# Altium schematic sheet LEDs.SchDoc: Thymio2
size A3; Engineer: Michael Bonani; Organization: Original design LSRO-STI-EPFL; Address1: Association Mobsya; Address2: Michael Bonani; Address3: Ch. Closel 3; Address4: CH-1020 Renens; DocumentNumber: 6; Revision: 2.3; SheetNumber: 6; SheetTotal: 9; Title2: PCB principal
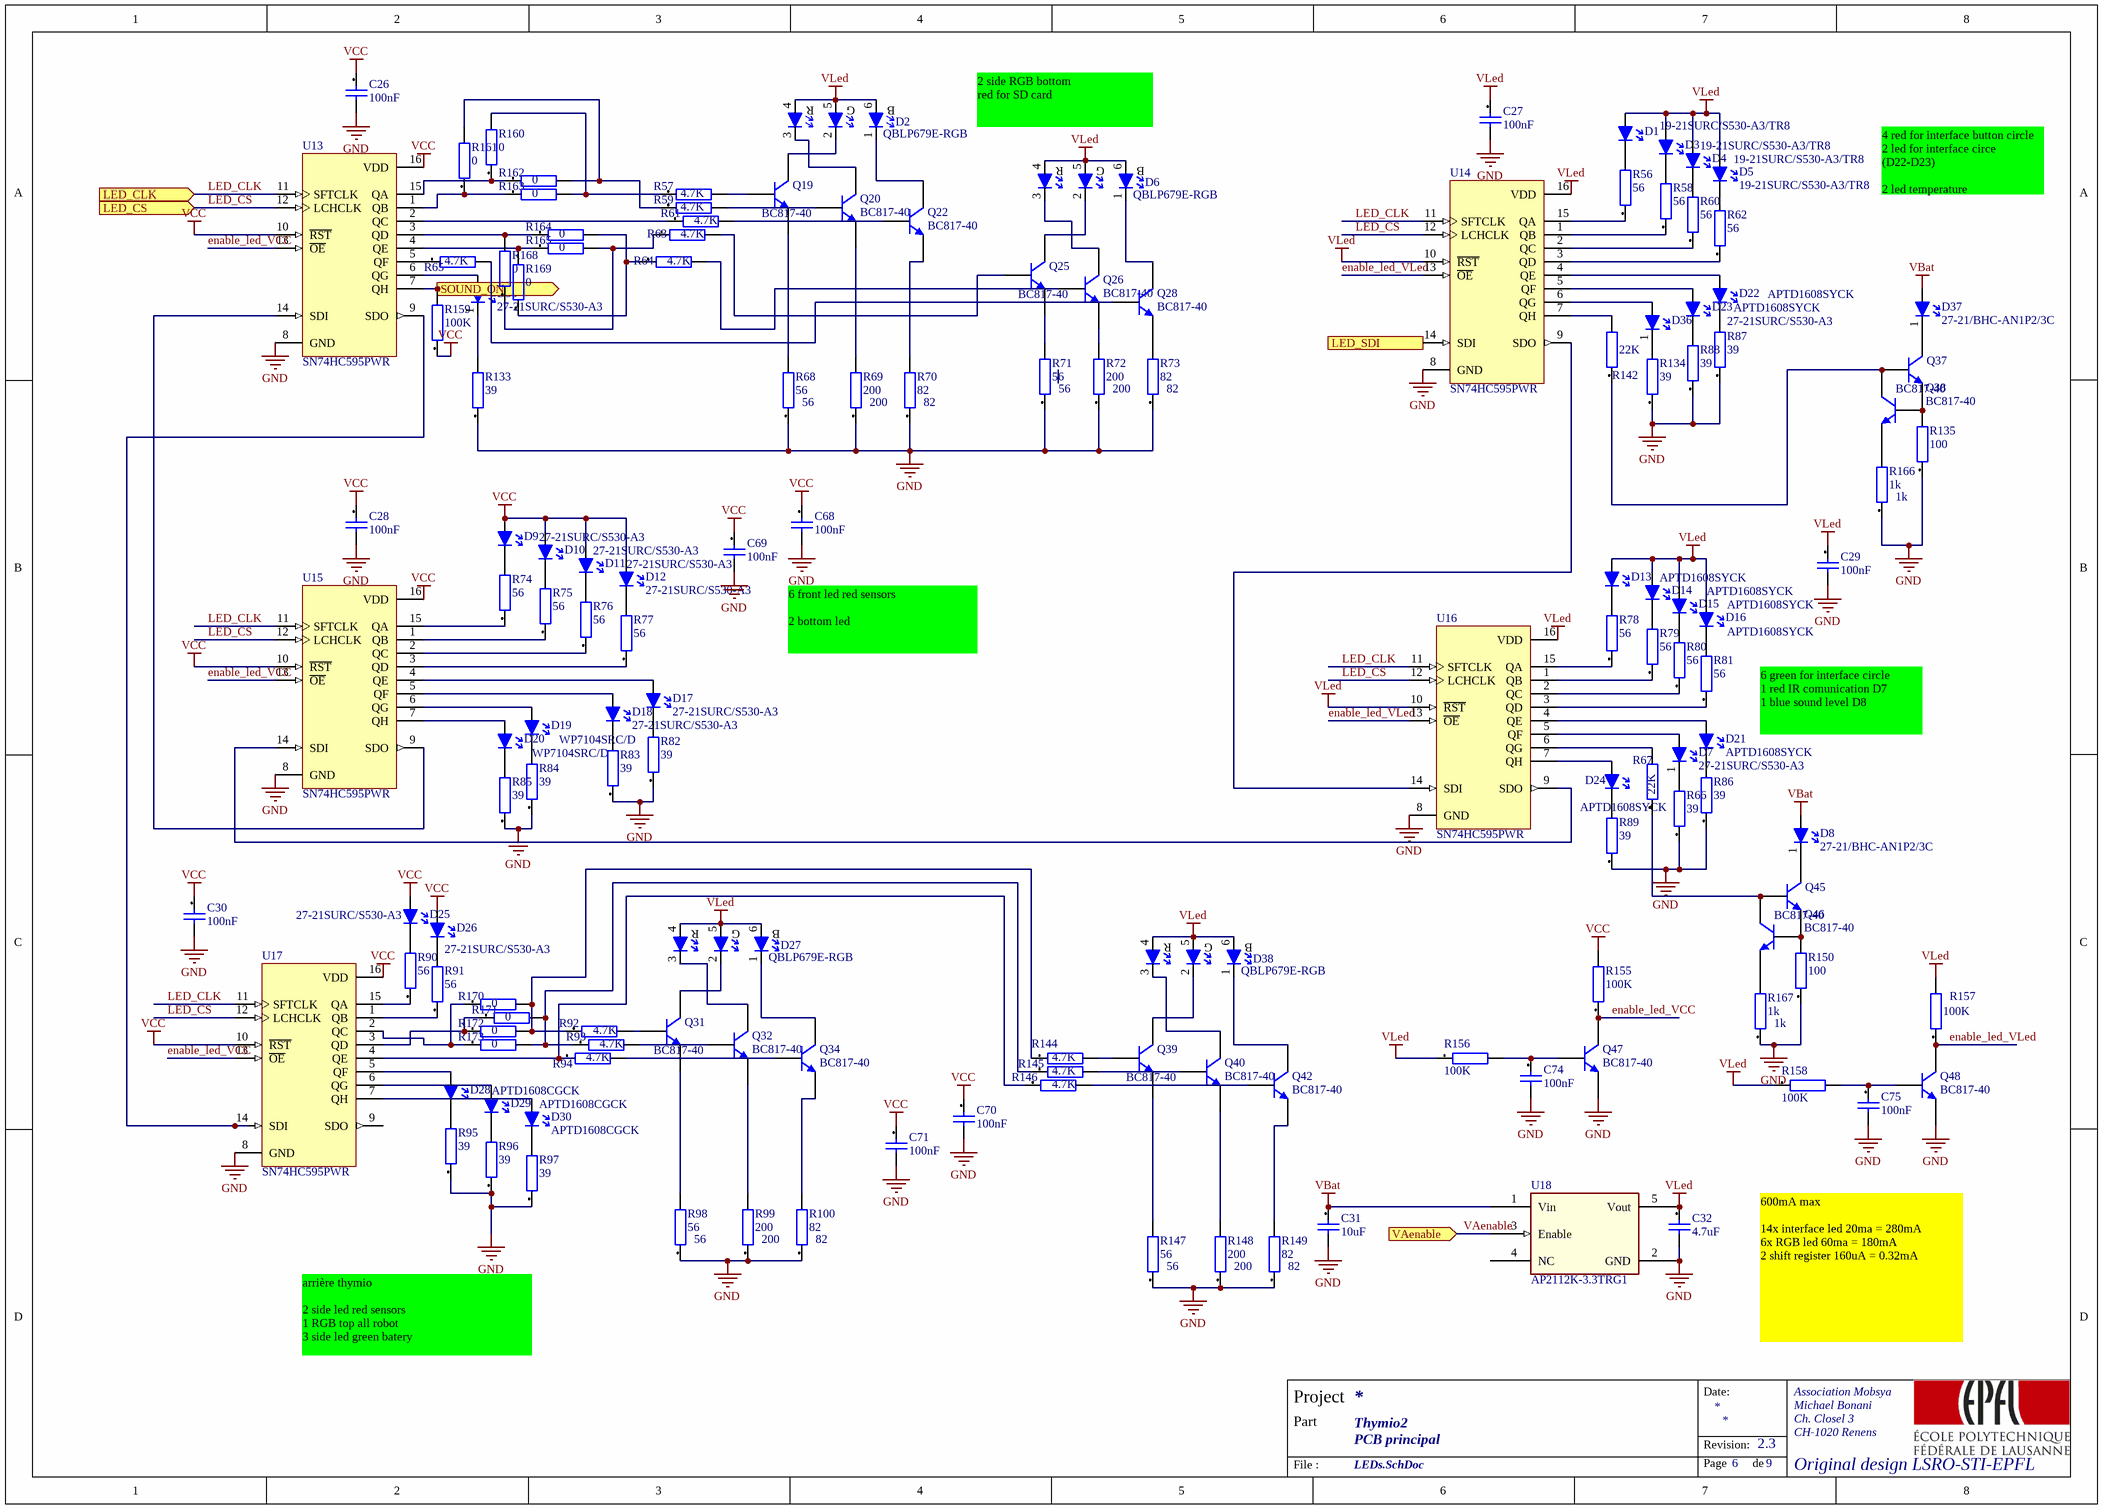
[diagram p0: LEDs.SchDoc]

## Parts
C26  100nF  [CAPC1005X05N]
C27  100nF  [CAPC1005X05N]
C28  100nF  [CAPC1005X05N]
C29  100nF  [CAPC1005X05N]
C30  100nF  [CAPC1005X05N]
C31  10uF  [CAPC1005X05N]
C32  4.7uF  [CAPC1005X05N]
C68  100nF  [CAPC1005X05N]
C69  100nF  [CAPC1005X05N]
C70  100nF  [CAPC1005X05N]
C71  100nF  [CAPC1005X05N]
C74  100nF  [CAPC1005X05N]
C75  100nF  [CAPC1005X05N]
D1  19-21SURC/S530-A3/TR8  [DIOC1608X08N]
D2  QBLP679E-RGB  [QBLP679E-RGB]
D3  19-21SURC/S530-A3/TR8  [DIOC1608X08N]
D4  19-21SURC/S530-A3/TR8  [DIOC1608X08N]
D5  19-21SURC/S530-A3/TR8  [DIOC1608X08N]
D6  QBLP679E-RGB  [QBLP679E-RGB]
D7  27-21SURC/S530-A3  [27-21 Everlight]
D8  27-21/BHC-AN1P2/3C  [27-21 Everlight Blue]
D9  27-21SURC/S530-A3  [27-21 Everlight]
D10  27-21SURC/S530-A3  [27-21 Everlight]
D11  27-21SURC/S530-A3  [27-21 Everlight]
D12  27-21SURC/S530-A3  [27-21 Everlight]
D13  APTD1608SYCK  [DIOC1608X08N]
D14  APTD1608SYCK  [DIOC1608X08N]
D15  APTD1608SYCK  [DIOC1608X08N]
D16  APTD1608SYCK  [DIOC1608X08N]
D17  27-21SURC/S530-A3  [27-21 Everlight]
D18  27-21SURC/S530-A3  [27-21 Everlight]
D19  WP7104SRC/D  [Led_TH_3mm_20mm]
D20  WP7104SRC/D  [Led_TH_3mm_20mm]
D21  APTD1608SYCK  [DIOC1608X08N]
D22  APTD1608SYCK  [DIOC1608X08N]
D23  APTD1608SYCK  [DIOC1608X08N]
D24  APTD1608SYCK  [DIOC1608X08N]
D25  27-21SURC/S530-A3  [27-21 Everlight]
D26  27-21SURC/S530-A3  [27-21 Everlight]
D27  QBLP679E-RGB  [QBLP679E-RGB]
D28  APTD1608CGCK  [DIOC1608X08N]
D29  APTD1608CGCK  [DIOC1608X08N]
D30  APTD1608CGCK  [DIOC1608X08N]
D35  27-21SURC/S530-A3  [27-21 Everlight]
D36  27-21SURC/S530-A3  [27-21 Everlight]
D37  27-21/BHC-AN1P2/3C  [27-21 Everlight Blue]
D38  QBLP679E-RGB  [QBLP679E-RGB]
Q19  BC817-40  [SOT23_N]
Q20  BC817-40  [SOT23_N]
Q22  BC817-40  [SOT23_N]
Q25  BC817-40  [SOT23_N]
Q26  BC817-40  [SOT23_N]
Q28  BC817-40  [SOT23_N]
Q31  BC817-40  [SOT23_N]
Q32  BC817-40  [SOT23_N]
Q34  BC817-40  [SOT23_N]
Q37  BC817-40  [SOT23_N]
Q38  BC817-40  [SOT23_N]
Q39  BC817-40  [SOT23_N]
Q40  BC817-40  [SOT23_N]
Q42  BC817-40  [SOT23_N]
Q45  BC817-40  [SOT23_N]
Q46  BC817-40  [SOT23_N]
Q47  BC817-40  [SOT23_N]
Q48  BC817-40  [SOT23_N]
R56  56  [RESC1005X04N]
R57  4.7K  [RESC1005X04N]
R58  56  [RESC1005X04N]
R59  4.7K  [RESC1005X04N]
R60  56  [RESC1005X04N]
R61  4.7K  [RESC1005X04N]
R62  56  [RESC1005X04N]
R63  4.7K  [RESC1005X04N]
R64  4.7K  [RESC1005X04N]
R65  4.7K  [RESC1005X04N]
R66  39  [RESC1005X04N]
R67  22K  [RESC1005X04N]
R68  56  [RESC1005X04N]
R69  200  [RESC1005X04N]
R70  82  [RESC1005X04N]
R71  56  [RESC1005X04N]
R72  200  [RESC1005X04N]
R73  82  [RESC1005X04N]
R74  56  [RESC1005X04N]
R75  56  [RESC1005X04N]
R76  56  [RESC1005X04N]
R77  56  [RESC1005X04N]
R78  56  [RESC1005X04N]
R79  56  [RESC1005X04N]
R80  56  [RESC1005X04N]
R81  56  [RESC1005X04N]
R82  39  [RESC1005X04N]
R83  39  [RESC1005X04N]
R84  39  [RESC1005X04N]
R85  39  [RESC1005X04N]
R86  39  [RESC1005X04N]
R87  39  [RESC1005X04N]
R88  39  [RESC1005X04N]
R89  39  [RESC1005X04N]
R90  56  [RESC1005X04N]
R91  56  [RESC1005X04N]
R92  4.7K  [RESC1005X04N]
R93  4.7K  [RESC1005X04N]
R94  4.7K  [RESC1005X04N]
R95  39  [RESC1005X04N]
R96  39  [RESC1005X04N]
R97  39  [RESC1005X04N]
R98  56  [RESC1005X04N]
R99  200  [RESC1005X04N]
R100  82  [RESC1005X04N]
R133  39  [RESC1005X04N]
R134  39  [RESC1005X04N]
R135  100  [RESC1005X04N]
R142  22K  [RESC1005X04N]
R144  4.7K  [RESC1005X04N]
R145  4.7K  [RESC1005X04N]
R146  4.7K  [RESC1005X04N]
R147  56  [RESC1005X04N]
R148  200  [RESC1005X04N]
R149  82  [RESC1005X04N]
R150  100  [RESC1005X04N]
R155  100K  [RESC1005X04N]
R156  100K  [RESC1005X04N]
R157  100K  [RESC1005X04N]
R158  100K  [RESC1005X04N]
R159  100K  [RESC1005X04N]
R160  0  [RESC1005X04N]
R161  0  [RESC1005X04N]
R162  0  [RESC1005X04N]
R163  0  [RESC1005X04N]
R164  0  [RESC1005X04N]
R165  0  [RESC1005X04N]
R166  1k  [RESC1005X04N]
R167  1k  [RESC1005X04N]
R168  0  [RESC1005X04N]
R169  0  [RESC1005X04N]
R170  0  [RESC1005X04N]
R171  0  [RESC1005X04N]
R172  0  [RESC1005X04N]
R173  0  [RESC1005X04N]
U13  SN74HC595PWR  [948F-01_N]
U14  SN74HC595PWR  [948F-01_N]
U15  SN74HC595PWR  [948F-01_N]
U16  SN74HC595PWR  [948F-01_N]
U17  SN74HC595PWR  [948F-01_N]
U18  AP2112K-3.3TRG1  [SOT95P285X100-5N]

## Ports
LED_CLK (in), LED_CS (in), LED_SDI (in), SOUND_ON (out), VAenable (in)

## Nets
GND: C26.2 C27.2 C28.2 C29.2 C30.2 C31.2 C32.2 C68.2 C69.2 C70.2 C71.2 C74.2 C75.2 Q47.2(E) Q48.2(E) R66.1 R68.1 R69.1 R70.1 R71.1 R72.1 R73.1 R82.1 R83.1 R84.1 R85.1 R86.1 R87.1 R88.1 R89.1 R95.1 R96.1 R97.1 R98.1 R99.1 R100.1 R133.1 R134.1 R135.1 R147.1 R148.1 R149.1 R150.1 R166.1 R167.1 U13.8(GND) U14.8(GND) U15.8(GND) U16.8(GND) U17.8(GND) U18.2(GND)
VBat: C31.1 D8.2(A) D37.2(A) U18.1(Vin)
VCC: C26.1 C28.1 C30.1 C68.1 C69.1 C70.1 C71.1 D9.2(A) D10.2(A) D11.2(A) D12.2(A) D25.2(A) D26.2(A) R155.2 R159.1 U13.10(~{RST}) U13.16(VDD) U15.10(~{RST}) U15.16(VDD) U17.10(~{RST}) U17.16(VDD)
VLed: C27.1 C29.1 C32.1 D1.2(A) D2.4(Ar) D2.5(Ag) D2.6(Ab) D3.2(A) D4.2(A) D5.2(A) D6.4(Ar) D6.5(Ag) D6.6(Ab) D13.2(A) D14.2(A) D15.2(A) D16.2(A) D27.4(Ar) D27.5(Ag) D27.6(Ab) D38.4(Ar) D38.5(Ag) D38.6(Ab) R156.1 R157.2 R158.1 U14.10(~{RST}) U14.16(VDD) U16.10(~{RST}) U16.16(VDD) U18.5(Vout)
enable_led_VCC: Q47.3(C) R155.1 U13.13(~{OE}) U15.13(~{OE}) U17.13(~{OE})
enable_led_VLed: Q48.3(C) R157.1 U14.13(~{OE}) U16.13(~{OE})
LED_CLK: U13.11(SFTCLK) U14.11(SFTCLK) U15.11(SFTCLK) U16.11(SFTCLK) U17.11(SFTCLK) ; port LED_CLK
LED_CS: U13.12(LCHCLK) U14.12(LCHCLK) U15.12(LCHCLK) U16.12(LCHCLK) U17.12(LCHCLK) ; port LED_CS
LED_SDI: U14.14(SDI) ; port LED_SDI
SOUND_ON: R159.2 U13.7(QH) ; port SOUND_ON
VAenable: U18.3(Enable) ; port VAenable
NetC74_1: C74.1 Q47.1(B) R156.2
NetC75_1: C75.1 Q48.1(B) R158.2
NetD1_1: D1.1(K) R56.2
NetD2_1: D2.1(Kb) Q22.3(C)
NetD2_2: D2.2(Kg) Q19.3(C)
NetD2_3: D2.3(Kr) Q20.3(C)
NetD3_1: D3.1(K) R58.2
NetD4_1: D4.1(K) R60.2
NetD5_1: D5.1(K) R62.2
NetD6_1: D6.1(Kb) Q28.3(C)
NetD6_2: D6.2(Kg) Q25.3(C)
NetD6_3: D6.3(Kr) Q26.3(C)
NetD7_1: D7.1(K) R66.2
NetD7_2: D7.2(A) U16.5(QF)
NetD8_1: D8.1(K) Q45.3(C)
NetD9_1: D9.1(K) R74.2
NetD10_1: D10.1(K) R75.2
NetD11_1: D11.1(K) R76.2
NetD12_1: D12.1(K) R77.2
NetD13_1: D13.1(K) R78.2
NetD14_1: D14.1(K) R79.2
NetD15_1: D15.1(K) R80.2
NetD16_1: D16.1(K) R81.2
NetD17_1: D17.1(K) R82.2
NetD17_2: D17.2(A) U15.4(QE)
NetD18_1: D18.1(K) R83.2
NetD18_2: D18.2(A) U15.5(QF)
NetD19_1: D19.1(K) R84.2
NetD19_2: D19.2(A) U15.6(QG)
NetD20_1: D20.1(K) R85.2
NetD20_2: D20.2(A) U15.7(QH)
NetD21_1: D21.1(K) R86.2
NetD21_2: D21.2(A) U16.4(QE)
NetD22_1: D22.1(K) R87.2
NetD22_2: D22.2(A) U14.4(QE)
NetD23_1: D23.1(K) R88.2
NetD23_2: D23.2(A) U14.5(QF)
NetD24_1: D24.1(K) R89.2
NetD24_2: D24.2(A) U16.7(QH)
NetD25_1: D25.1(K) R90.2
NetD26_1: D26.1(K) R91.2
NetD27_1: D27.1(Kb) Q34.3(C)
NetD27_2: D27.2(Kg) Q31.3(C)
NetD27_3: D27.3(Kr) Q32.3(C)
NetD28_1: D28.1(K) R95.2
NetD28_2: D28.2(A) U17.5(QF)
NetD29_1: D29.1(K) R96.2
NetD29_2: D29.2(A) U17.6(QG)
NetD30_1: D30.1(K) R97.2
NetD30_2: D30.2(A) U17.7(QH)
NetD35_1: D35.1(K) R133.2
NetD35_2: D35.2(A) U13.6(QG)
NetD36_1: D36.1(K) R134.2
NetD36_2: D36.2(A) U14.6(QG)
NetD37_1: D37.1(K) Q37.3(C)
NetD38_1: D38.1(Kb) Q42.3(C)
NetD38_2: D38.2(Kg) Q39.3(C)
NetD38_3: D38.3(Kr) Q40.3(C)
NetQ19_1: Q19.1(B) R57.2
NetQ19_2: Q19.2(E) R68.2
NetQ20_1: Q20.1(B) R59.2
NetQ20_2: Q20.2(E) R69.2
NetQ22_1: Q22.1(B) R61.2
NetQ22_2: Q22.2(E) R70.2
NetQ25_1: Q25.1(B) R63.2
NetQ25_2: Q25.2(E) R71.2
NetQ26_1: Q26.1(B) R64.2
NetQ26_2: Q26.2(E) R72.2
NetQ28_1: Q28.1(B) R65.2
NetQ28_2: Q28.2(E) R73.2
NetQ31_1: Q31.1(B) R92.2
NetQ31_2: Q31.2(E) R98.2
NetQ32_1: Q32.1(B) R93.2
NetQ32_2: Q32.2(E) R99.2
NetQ34_1: Q34.1(B) R94.2
NetQ34_2: Q34.2(E) R100.2
NetQ37_1: Q37.1(B) Q38.3(C) R142.1
NetQ37_2: Q37.2(E) Q38.1(B) R135.2
NetQ38_2: Q38.2(E) R166.2
NetQ39_1: Q39.1(B) R144.2
NetQ39_2: Q39.2(E) R147.2
NetQ40_1: Q40.1(B) R145.2
NetQ40_2: Q40.2(E) R148.2
NetQ42_1: Q42.1(B) R146.2
NetQ42_2: Q42.2(E) R149.2
NetQ45_1: Q45.1(B) Q46.3(C) R67.1
NetQ45_2: Q45.2(E) Q46.1(B) R150.2
NetQ46_2: Q46.2(E) R167.2
NetR56_1: R56.1 U14.15(QA)
NetR57_1: R57.1 R160.2 R163.2
NetR58_1: R58.1 U14.1(QB)
NetR59_1: R59.1 R161.2 R162.2
NetR60_1: R60.1 U14.2(QC)
NetR61_1: R61.1 U13.2(QC)
NetR62_1: R62.1 U14.3(QD)
NetR63_1: R63.1 R165.2 R168.1
NetR64_1: R64.1 R164.2 R169.1
NetR65_1: R65.1 U13.5(QF)
NetR67_2: R67.2 U16.6(QG)
NetR74_1: R74.1 U15.15(QA)
NetR75_1: R75.1 U15.1(QB)
NetR76_1: R76.1 U15.2(QC)
NetR77_1: R77.1 U15.3(QD)
NetR78_1: R78.1 U16.15(QA)
NetR79_1: R79.1 U16.1(QB)
NetR80_1: R80.1 U16.2(QC)
NetR81_1: R81.1 U16.3(QD)
NetR90_1: R90.1 U17.15(QA)
NetR91_1: R91.1 U17.1(QB)
NetR92_1: R92.1 R144.1 R170.2 R172.2
NetR93_1: R93.1 R145.1 R171.2 R173.2
NetR94_1: R94.1 R146.1 U17.4(QE)
NetR142_2: R142.2 U14.7(QH)
NetR160_1: R160.1 R162.1 U13.15(QA)
NetR161_1: R161.1 R163.1 U13.1(QB)
NetR164_1: R164.1 R168.2 U13.3(QD)
NetR165_1: R165.1 R169.2 U13.4(QE)
NetR170_1: R170.1 R173.1 U17.2(QC)
NetR171_1: R171.1 R172.1 U17.3(QD)
NetU13_9: U13.9(SDO) U17.14(SDI)
NetU13_14: U13.14(SDI) U15.9(SDO)
NetU14_9: U14.9(SDO) U16.14(SDI)
NetU15_14: U15.14(SDI) U16.9(SDO)

Not connected (* = marked no-connect by the designer): U17 9(SDO); U18 4(NC)

## Notes on the sheet
- (near D6) 2 side RGB bottom
  red for SD card
- 4 red for interface button circle
  2 led for interface circe (D22-D23)
  2 led temperature
- 6 front led red sensors
  2 bottom led
- 6 green for interface circle
  1 red IR comunication D7
  1 blue sound level D8
- arrière thymio
  2 side led red sensors
  1 RGB top all robot
  3 side led green batery
- 600mA max
  14x interface led 20ma = 280mA
  6x RGB led 60ma = 180mA
  2 shift register 160uA = 0.32mA
- Date:
- Project
- Part
- Revision:
- File :
- Page
- de
- (in symbol LED RGB SMD 2) R; G; B

## Library data of the parts
C26 C28 C30 C68-C71 C74 C75 = 100nF[[/\]]0603[[/\]]1: Capacitor; Manufacturer: Kemet; Manufacturer Nr: C0603C104K5RAC; Preference: 1; Tolerance +: +10; Tolerance -: -10; Dielectric: X7R; Voltage: 50; MaxTemperature: +125; MinTemperature: -55; Quant_1: 10; Quant_2: 100; Quant_3: 1000; Quant_4: 4000; Currentie: CHF; Size: 0603; Footprint Acort: 0603_G; Supplier: Farnell; Supplier Nr: 1288255; ComponentLink2Description: Farnell link; ComponentLink2URL: http://ch.farnell.com/jsp/displayProduct.jsp?sku=1288255; Price_1: 0.046; Price_2: 0.04; Price_3: 0.037; Price_4: 0.036; ROHS: True; DateLastUpdate: 2007-12-03 / 14:22:31
C27 C29 = 100nF[[/\]]0603[[/\]]1: Capacitor; Manufacturer: Kemet; Manufacturer Nr: C0603C104K5RAC; Preference: 1; Tolerance +: +10; Tolerance -: -10; Dielectric: X7R; Voltage: 50; MaxTemperature: +125; MinTemperature: -55; Quant_1: 10; Quant_2: 100; Quant_3: 1000; Quant_4: 4000; Currentie: CHF; LayerSch: Top; Size: 0603; Footprint Acort: 0603_G; Supplier: Farnell; Supplier Nr: 1288255; ComponentLink2Description: Farnell link; ComponentLink2URL: http://ch.farnell.com/jsp/displayProduct.jsp?sku=1288255; Price_1: 0.046; Price_2: 0.04; Price_3: 0.037; Price_4: 0.036; ROHS: True; DateLastUpdate: 2007-12-03 / 14:22:31
C31 C32 = 4.7uF[[/\]]0603[[/\]]1: Capacitor; Manufacturer: Kemet; Manufacturer Nr: C0603C475K9PAC; Preference: 1; Tolerance +: +10; Tolerance -: -10; Dielectric: X5R; Voltage: 6.3; MaxTemperature: +85; MinTemperature: -55; Quant_1: 10; Quant_2: 100; Quant_3: 1000; Quant_4: 4000; Currentie: CHF; LayerSch: Top; Size: 0603; Footprint Acort: 0603_G; Supplier: Farnell; Supplier Nr: 9227784; ComponentLink2Description: Farnell link; ComponentLink2URL: http://ch.farnell.com/jsp/displayProduct.jsp?sku=9227784; Price_1: 0.33; Price_2: 0.298; Price_3: 0.278; Price_4: 0.246; ROHS: True; DateLastUpdate: 2007-12-03 / 14:22:57
D1 D3-D5 = LED: SMD Red 0603 2V@20ma 56 mcd; VerifiedComment: ToDo; LayerSch: Top
D2 D6 D27 D38 = LED RGB SMD 2: =Value: HBMGFRT825; VerifiedComment: ToDo; LayerSch: Top
D7 D36 = LED: SMD Red led right angle mount 2V@20ma 57mcd; VerifiedComment: ToDo; LayerSch: Top
D8 D37 = LED: SMD Blue led right angle mount 3.3V@20ma 28mcd; VerifiedComment: ToDo; LayerSch: Top
D9-D12 D17 D18 D25 D26 D35 = LED: SMD Red led right angle mount 2V@20ma 57mcd; VerifiedComment: ToDo
D13-D16 D21-D24 = LED: LED standard - CMS Helios SMD Yellow 590nm 480mcd; VerifiedComment: ToDo; LayerSch: Top
D19 D20 = LED: Red led 2V@20ma 57mcd; VerifiedComment: ToDo
D28-D30 = LED: LED standard - CMS Helios SMD Green 570nm 230mcd; VerifiedComment: ToDo; LayerSch: Top
Q19 Q20 Q22 Q25 Q26 Q28 = BC817-40: NPN General-purpose Transistor; Published: 17-Sep-2003; LatestRevisionDate: 12-Dec-2006; LatestRevisionNote: IPC-7351 Footprint Added.; DatasheetVersion: Jun-1999; PackageVersion: May-1999; PackageReference: SOT23; Publisher: Altium Limited; PackageDescription: 3-Pin SOT-23 Package 0.95 mm Pitch, 2.3 mm Lead Span; ComponentLink1Description: Manufacturer Link; ComponentLink1URL: http://www.semiconductors.philips.com/; ComponentLink2Description: Datasheet; ComponentLink2URL: http://www.semiconductors.philips.com/acrobat/datasheets/BC817_BC817W_BC337_5.pdf
Q31 Q32 Q34 Q37-Q40 Q42 Q45-Q48 = BC817-40: NPN General-purpose Transistor; LayerSch: Top; Published: 17-Sep-2003; LatestRevisionDate: 12-Dec-2006; LatestRevisionNote: IPC-7351 Footprint Added.; DatasheetVersion: Jun-1999; PackageVersion: May-1999; PackageReference: SOT23; Publisher: Altium Limited; PackageDescription: 3-Pin SOT-23 Package 0.95 mm Pitch, 2.3 mm Lead Span; ComponentLink1Description: Manufacturer Link; ComponentLink1URL: http://www.semiconductors.philips.com/; ComponentLink2Description: Datasheet; ComponentLink2URL: http://www.semiconductors.philips.com/acrobat/datasheets/BC817_BC817W_BC337_5.pdf
R56 R58 R60 R62 R66 R78-R81 R86-R89 R134 = 68K[[/\]]0603[[/\]]1: Resistor; Manufacturer: Vishay; Manufacturer Nr: D11CRCW06030B6802F; Tolerance: +/-1; Preference: 1; Power: 0.1; Voltage: 75; Current: 1.5; ppm/K: +/-100; Quant_1: 10; Quant_2: 100; Quant_3: 500; Currentie: CHF; LayerSch: Top; Size: 0603; Footprint Acort: 0603; Supplier: Distrelec; Supplier Nr: 715632; ComponentLink2Description: Distrelec link; ComponentLink2URL: http://www.distrelec.com/ishopWebFront/search/luceneSearch.do?dispatch=find&showImage=on&artnrPhrase=715632; ROHS: True; Price_1: 0.0538; Price_2: 0.0323; Price_3: 0.0204; DateLastUpdate: 2007-12-03 / 16:30:21
R57 R59 R61 R63-R65 = 4.7K[[/\]]0603[[/\]]1: Resistor; Manufacturer: Vishay; Manufacturer Nr: D11CRCW06030B4701F; Tolerance: +/-1; Preference: 1; Power: 0.1; Voltage: 75; Current: 1.5; ppm/K: +/-100; Quant_1: 10; Quant_2: 100; Quant_3: 500; Currentie: CHF; Size: 0603; Footprint Acort: 0603; Supplier: Distrelec; Supplier Nr: 715604; ComponentLink2Description: Distrelec link; ComponentLink2URL: http://www.distrelec.com/ishopWebFront/search/luceneSearch.do?dispatch=find&showImage=on&artnrPhrase=715604; ROHS: True; Price_1: 0.0538; Price_2: 0.0323; Price_3: 0.0204; DateLastUpdate: 2007-12-03 / 16:30:20
R67 R92-R94 R142 R144-R146 R155-R165 R168-R173 = 4.7K[[/\]]0603[[/\]]1: Resistor; Manufacturer: Vishay; Manufacturer Nr: D11CRCW06030B4701F; Tolerance: +/-1; Preference: 1; Power: 0.1; Voltage: 75; Current: 1.5; ppm/K: +/-100; Quant_1: 10; Quant_2: 100; Quant_3: 500; Currentie: CHF; LayerSch: Top; Size: 0603; Footprint Acort: 0603; Supplier: Distrelec; Supplier Nr: 715604; ComponentLink2Description: Distrelec link; ComponentLink2URL: http://www.distrelec.com/ishopWebFront/search/luceneSearch.do?dispatch=find&showImage=on&artnrPhrase=715604; ROHS: True; Price_1: 0.0538; Price_2: 0.0323; Price_3: 0.0204; DateLastUpdate: 2007-12-03 / 16:30:20
R68-R73 = RES
  R68 R71: Value: 56
  R69 R72: Value: 200
  R70 R73: Value: 82
R74-R77 R82-R85 R90 R91 R95-R97 R133 = 68K[[/\]]0603[[/\]]1: Resistor; Manufacturer: Vishay; Manufacturer Nr: D11CRCW06030B6802F; Tolerance: +/-1; Preference: 1; Power: 0.1; Voltage: 75; Current: 1.5; ppm/K: +/-100; Quant_1: 10; Quant_2: 100; Quant_3: 500; Currentie: CHF; Size: 0603; Footprint Acort: 0603; Supplier: Distrelec; Supplier Nr: 715632; ComponentLink2Description: Distrelec link; ComponentLink2URL: http://www.distrelec.com/ishopWebFront/search/luceneSearch.do?dispatch=find&showImage=on&artnrPhrase=715632; ROHS: True; Price_1: 0.0538; Price_2: 0.0323; Price_3: 0.0204; DateLastUpdate: 2007-12-03 / 16:30:21
R98-R100 R147-R149 = RES: LayerSch: Top
  R98 R147: Value: 56
  R99 R148: Value: 200
  R100 R149: Value: 82
R135 R150 = 68K[[/\]]0603[[/\]]1: Resistor; Manufacturer: Vishay; Manufacturer Nr: D11CRCW06030B6802F; Tolerance: +/-1; Preference: 1; Power: 0.1; Voltage: 75; Current: 1.5; ppm/K: +/-100; Quant_1: 10; Quant_3: 500; Currentie: CHF; LayerSch: Top; Size: 0603; Footprint Acort: 0603; Supplier: Distrelec; Supplier Nr: 715632; ComponentLink2Description: Distrelec link; ComponentLink2URL: http://www.distrelec.com/ishopWebFront/search/luceneSearch.do?dispatch=find&showImage=on&artnrPhrase=715632; ROHS: True; Price_1: 0.0538; Quant_2: 100; Price_2: 0.0323; Price_3: 0.0204; DateLastUpdate: 2007-12-03 / 16:30:21
R166 R167 = RES: 120; Value: 1k
U13 U15 U17 = MC74HC595ADTR2: 8-Bit Serial-Input/Serial or Prallel-Output Shift Register with Latched 3-State Outputs; Published: 15-Apr-2002; LatestRevisionDate: 12-Dec-2006; LatestRevisionNote: IPC-7351 Footprint Added.; DatasheetVersion: Mar-2000; PackageVersion: Feb-2000; PackageReference: 948F-01; Publisher: Altium Limited; PackageDescription: 16-Pin Thin Small Outline Package 0.65 mm Pitch; ComponentLink1Description: Manufacturer Link; ComponentLink1URL: http://www.onsemi.com/; ComponentLink2Description: Datasheet; ComponentLink2URL: http://www.onsemi.com/pub/Collateral/MC74HC595A-D.PDF
U14 U16 = MC74HC595ADTR2: 8-Bit Serial-Input/Serial or Prallel-Output Shift Register with Latched 3-State Outputs; LayerSch: Top; Published: 15-Apr-2002; LatestRevisionDate: 12-Dec-2006; LatestRevisionNote: IPC-7351 Footprint Added.; DatasheetVersion: Mar-2000; PackageVersion: Feb-2000; PackageReference: 948F-01; Publisher: Altium Limited; PackageDescription: 16-Pin Thin Small Outline Package 0.65 mm Pitch; ComponentLink1Description: Manufacturer Link; ComponentLink1URL: http://www.onsemi.com/; ComponentLink2Description: Datasheet; ComponentLink2URL: http://www.onsemi.com/pub/Collateral/MC74HC595A-D.PDF
U18 = AP7331: 300mA, Low Quiescent Current, Fast Transient LDO; LayerSch: Top